# Altium schematic sheet MicroMultimeter__MYPROBE_Sch.SchDoc: MicroMultimeter - Probe
size 152 x 101 mm; Author: Hom; CompanyName: KitSprout; DrawnBy: Hom; Engineer: Hom; Organization: KitSprout; Revision: A; SheetNumber: 1; SheetTotal: 1; License: CC BY-SA 4.0; Version: 1.0; LibVersion: 1.4; PageSetup: Record=PageOptions|CenterHorizontal=True|CenterVertical=True|PrintScale=1.00|XCorrection=1.00|YCorrection=1.00|PrintKind=0|BorderSize=5000000|LeftOffset=0|BottomOffset=0|Orientation=2|PaperLength=1000|PaperWidth=1000|Scale=100|PaperSource=7|PrintQuality=-3|MediaType=1|DitherType=10|PrintScaleMode=0|PaperKind=A4|PaperIndex=9
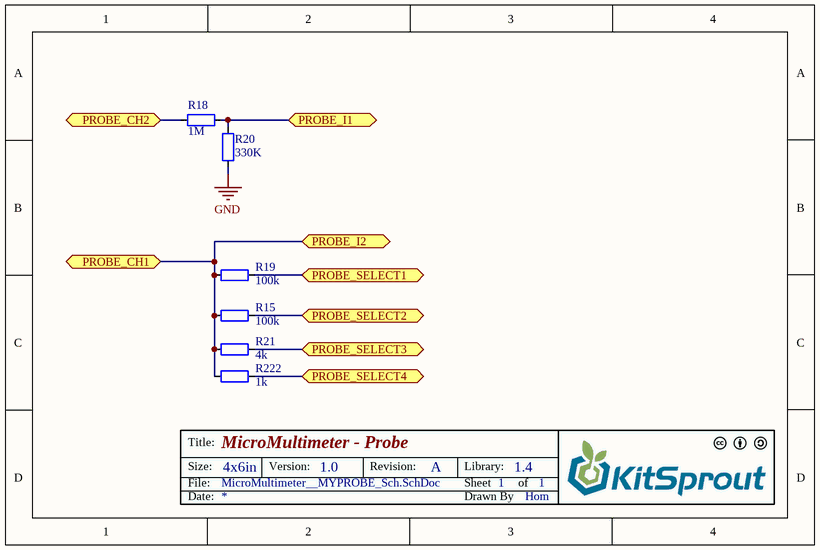
[diagram p0: MicroMultimeter__MYPROBE_Sch.SchDoc]

## Parts
R15  value 100k  [RES_0603]  (hidden comment: Res_0603)
R18  value 1M  [RES_0603]  (hidden comment: Res_0603)
R19  value 100k  [RES_0603]  (hidden comment: Res_0603)
R20  value 330K  [RES_0603]  (hidden comment: Res_0603)
R21  value 4k  [RES_0603]  (hidden comment: Res_0603)
R222  value 1k  [RES_0603]  (hidden comment: Res_0603)

## Ports
PROBE_CH1, PROBE_CH2 (bidir), PROBE_I1, PROBE_I2, PROBE_SELECT1, PROBE_SELECT2, PROBE_SELECT3, PROBE_SELECT4

## Nets
GND: R20.1
PROBE_CH1: R15.2 R19.2 R21.2 R222.2 ; port PROBE_CH1, port PROBE_I2
PROBE_CH2: R18.2 ; port PROBE_CH2
PROBE_I1: R18.1 R20.2 ; port PROBE_I1
PROBE_SELECT1: R19.1 ; port PROBE_SELECT1
PROBE_SELECT2: R15.1 ; port PROBE_SELECT2
PROBE_SELECT3: R21.1 ; port PROBE_SELECT3
PROBE_SELECT4: R222.1 ; port PROBE_SELECT4

## Notes on the sheet
- Title:
- Size:
- Date:
- File:
- 4x6in
- Version:
- Revision:
- Sheet
- Drawn By
- Library:
- of

## Library data of the parts
R15 R18-R21 R222 = Res_0603: Resistor